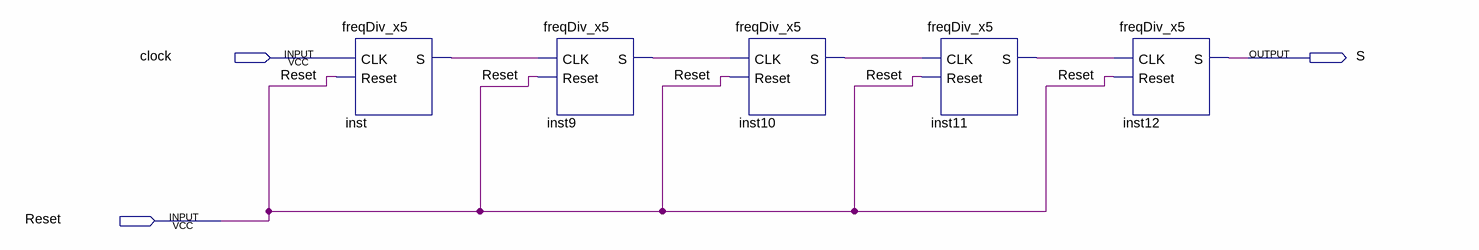
[diagram p0: schematic sheet]
// Quartus schematic feqDiv.bdf as structural Verilog: 5 symbols, 3 pins
module feqDiv (
  input  clock,
  input  Reset,
  output S
);

  wire inst9_s, inst10_s, inst11_s, inst_s;

  freqDiv_x5 inst (.CLK(clock), .Reset(Reset), .S(inst_s));
  freqDiv_x5 inst9 (.CLK(inst_s), .Reset(Reset), .S(inst9_s));
  freqDiv_x5 inst10 (.CLK(inst9_s), .Reset(Reset), .S(inst10_s));
  freqDiv_x5 inst11 (.CLK(inst10_s), .Reset(Reset), .S(inst11_s));
  freqDiv_x5 inst12 (.CLK(inst11_s), .Reset(Reset), .S(S));
endmodule
